# Altium schematic sheet SDEC944-xD_Fil_Pilote_2-2_(zone_jour).SchDoc: Fil Pilote (2/2)
size 393 x 270 mm; CompanyName: Seccom; Address1: 521, rue du capt. François Garbit; Address2: 69440 Mornant; Address3: seccom@seccom.fr; Address4: www.seccom.fr; DocumentNumber: 15; SheetNumber: 15; SheetTotal: 22; PageSetup: Record=PageOptions|CenterHorizontal=True|CenterVertical=True|PrintScale=0.74|XCorrection=1.00|YCorrection=1.00|PrintKind=0|BorderSize=5000000|LeftOffset=0|BottomOffset=0|Orientation=2|PaperLength=1000|PaperWidth=1000|Scale=100|PaperSource=7|PrintQuality=-4|MediaType=1|DitherType=10|PaperKind=A4|PrintScaleMode=1
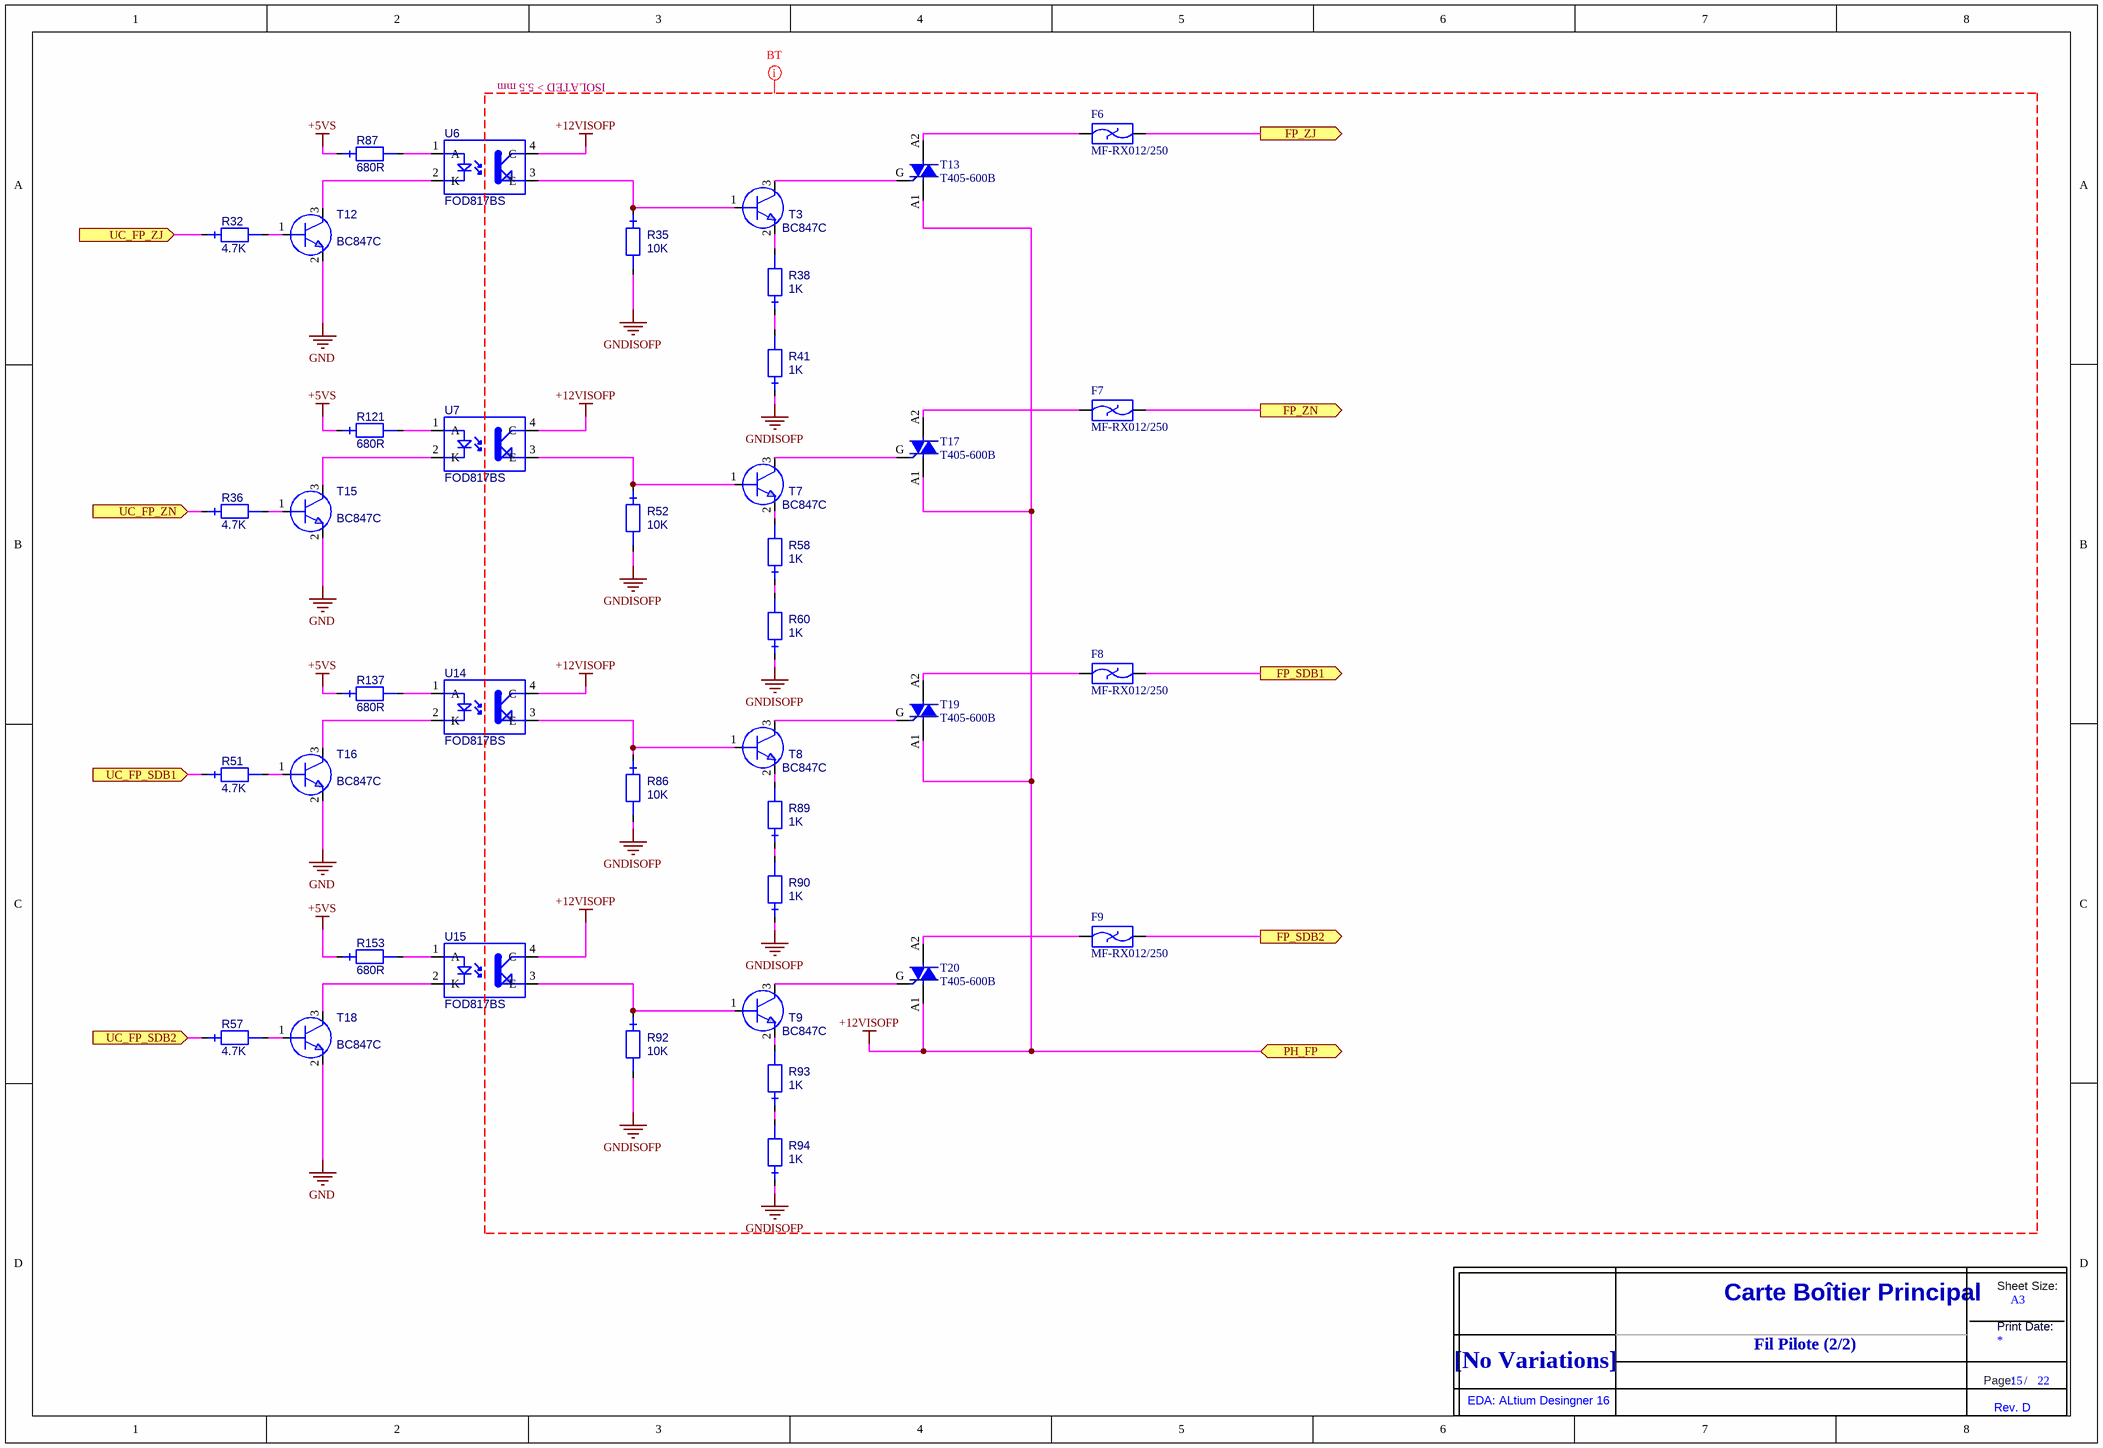
[diagram p0: SDEC944-xD_Fil_Pilote_2-2_(zone_jour).SchDoc]

## Parts
F6  MF-RX012/250  [MF-RX012-250-0]
F7  MF-RX012/250  [MF-RX012-250-0]
F8  MF-RX012/250  [MF-RX012-250-0]
F9  MF-RX012/250  [MF-RX012-250-0]
R32  value 4.7K  [0603_ReflowSoldering_RES]  (hidden comment: RES_0603_1%_100PPM_4.7K)
R35  value 10K  [0603_ReflowSoldering_RES]  (hidden comment: RES_0603_1%_100PPM_10K)
R36  value 4.7K  [0603_ReflowSoldering_RES]  (hidden comment: RES_0603_1%_100PPM_4.7K)
R38  value 1K  [0603_ReflowSoldering_RES]  (hidden comment: RES_0603_1%_100PPM_1K)
R41  value 1K  [0603_ReflowSoldering_RES]  (hidden comment: RES_0603_1%_100PPM_1K)
R51  value 4.7K  [0603_ReflowSoldering_RES]  (hidden comment: RES_0603_1%_100PPM_4.7K)
R52  value 10K  [0603_ReflowSoldering_RES]  (hidden comment: RES_0603_1%_100PPM_10K)
R57  value 4.7K  [0603_ReflowSoldering_RES]  (hidden comment: RES_0603_1%_100PPM_4.7K)
R58  value 1K  [0603_ReflowSoldering_RES]  (hidden comment: RES_0603_1%_100PPM_1K)
R60  value 1K  [0603_ReflowSoldering_RES]  (hidden comment: RES_0603_1%_100PPM_1K)
R86  value 10K  [0603_ReflowSoldering_RES]  (hidden comment: RES_0603_1%_100PPM_10K)
R87  value 680R  [0603_ReflowSoldering_RES]  (hidden comment: RES_0603_1%_100PPM_680R)
R89  value 1K  [0603_ReflowSoldering_RES]  (hidden comment: RES_0603_1%_100PPM_1K)
R90  value 1K  [0603_ReflowSoldering_RES]  (hidden comment: RES_0603_1%_100PPM_1K)
R92  value 10K  [0603_ReflowSoldering_RES]  (hidden comment: RES_0603_1%_100PPM_10K)
R93  value 1K  [0603_ReflowSoldering_RES]  (hidden comment: RES_0603_1%_100PPM_1K)
R94  value 1K  [0603_ReflowSoldering_RES]  (hidden comment: RES_0603_1%_100PPM_1K)
R121  value 680R  [0603_ReflowSoldering_RES]  (hidden comment: RES_0603_1%_100PPM_680R)
R137  value 680R  [0603_ReflowSoldering_RES]  (hidden comment: RES_0603_1%_100PPM_680R)
R153  value 680R  [0603_ReflowSoldering_RES]  (hidden comment: RES_0603_1%_100PPM_680R)
T3  BC847C  [SOT23_3L_ReflowSoldering]
T7  BC847C  [SOT23_3L_ReflowSoldering]
T8  BC847C  [SOT23_3L_ReflowSoldering]
T9  BC847C  [SOT23_3L_ReflowSoldering]
T12  BC847C  [SOT23_3L_ReflowSoldering]
T13  T405-600B  [DPAK]
T15  BC847C  [SOT23_3L_ReflowSoldering]
T16  BC847C  [SOT23_3L_ReflowSoldering]
T17  T405-600B  [DPAK]
T18  BC847C  [SOT23_3L_ReflowSoldering]
T19  T405-600B  [DPAK]
T20  T405-600B  [DPAK]
Title_new  DNI  (value not drawn)  (graphical)
U6  value FOD817BS  [OPTO_FOD817BS_ReflowSoldering]  (hidden comment: OPTO_FOD817BS)
U7  value FOD817BS  [OPTO_FOD817BS_ReflowSoldering]  (hidden comment: OPTO_FOD817BS)
U14  value FOD817BS  [OPTO_FOD817BS_ReflowSoldering]  (hidden comment: OPTO_FOD817BS)
U15  value FOD817BS  [OPTO_FOD817BS_ReflowSoldering]  (hidden comment: OPTO_FOD817BS)

## Ports
FP_SDB1 (out), FP_SDB2 (out), FP_ZJ (out), FP_ZN (out), PH_FP, UC_FP_SDB1 (in), UC_FP_SDB2 (in), UC_FP_ZJ (in), UC_FP_ZN (in)

## Nets
+5VS: R87.1 R121.1 R137.1 R153.1
+12VISOFP: T13.A1 T17.A1 T19.A1 T20.A1 U6.4(C) U7.4(C) U14.4(C) U15.4(C) ; port PH_FP
GND: T12.2(E) T15.2(E) T16.2(E) T18.2(E)
GNDISOFP: R35.2 R41.1 R52.2 R60.1 R86.2 R90.1 R92.2 R94.1
FP_SDB1: F8.2 ; port FP_SDB1
FP_SDB2: F9.2 ; port FP_SDB2
FP_ZJ: F6.2 ; port FP_ZJ
FP_ZN: F7.2 ; port FP_ZN
UC_FP_SDB1: R51.1 ; port UC_FP_SDB1
UC_FP_SDB2: R57.1 ; port UC_FP_SDB2
UC_FP_ZJ: R32.1 ; port UC_FP_ZJ
UC_FP_ZN: R36.1 ; port UC_FP_ZN
NetF6_1: F6.1 T13.A2
NetF7_1: F7.1 T17.A2
NetF8_1: F8.1 T19.A2
NetF9_1: F9.1 T20.A2
NetR32_2: R32.2 T12.1(B)
NetR35_1: R35.1 T3.1(B) U6.3(E)
NetR36_2: R36.2 T15.1(B)
NetR38_1: R38.1 R41.2
NetR38_2: R38.2 T3.2(E)
NetR51_2: R51.2 T16.1(B)
NetR52_1: R52.1 T7.1(B) U7.3(E)
NetR57_2: R57.2 T18.1(B)
NetR58_1: R58.1 R60.2
NetR58_2: R58.2 T7.2(E)
NetR86_1: R86.1 T8.1(B) U14.3(E)
NetR87_2: R87.2 U6.1(A)
NetR89_1: R89.1 R90.2
NetR89_2: R89.2 T8.2(E)
NetR92_1: R92.1 T9.1(B) U15.3(E)
NetR93_1: R93.1 R94.2
NetR93_2: R93.2 T9.2(E)
NetR121_2: R121.2 U7.1(A)
NetR137_2: R137.2 U14.1(A)
NetR153_2: R153.2 U15.1(A)
NetT3_3: T3.3(C) T13.G
NetT7_3: T7.3(C) T17.G
NetT8_3: T8.3(C) T19.G
NetT9_3: T9.3(C) T20.G
NetT12_3: T12.3(C) U6.2(K)
NetT15_3: T15.3(C) U7.2(K)
NetT16_3: T16.3(C) U14.2(K)
NetT18_3: T18.3(C) U15.2(K)

## Layout directives
net class BT: +12VISOFP, GNDISOFP

## Notes on the sheet
- ISOLATED > 5.5 mm
- Fil Pilote (2/2)
- (in symbol Title_new) Sheet Size:; Carte Boîtier Principal; A3; Print Date:; [No Variations]; Page:; /; EDA: ALtium Desingner 16; Rev. D

## Library data of the parts
F6-F9 = MF-RX012/250-0: Resettable Fuses - PPTC 0.12A 60V 4ohm Hold .12 Trip .16; Fabricant: Bourns Inc.; Ref Fab: MF-RX012/250-2; Value: MF-RX012/250-2; Supplier 1: Digi-Key; Supplier Part Number 1: MF-RX012/250-0-ND
R32 R36 R51 R57 = RES_0603_1%_100PPM_4.7K: Résistance, 0.100W, 1%, 100ppm, 75V, 4.7K; Creation: JPL (05/07/12); Boitier: 0603; Remarque: {Remarque}; Fabricant: Vishay; Ref Fab: CRCW06034K70FKEA; Coeff: 1; Verification: *; ComponentLink1URL: O:\_Documentation\Datasheets\Vishay\Resistances_D-CRCWe3.pdf; ComponentLink2URL: o:\_Documentation\Datasheets\_BOITIERS\PASSIF_CMS\; Config: *; ComponentLink1Description: Datasheet; ComponentLink2Description: Datasheet Boitier; Supplier 1: Farnell; Supplier 2: RadioSpares; Supplier Part Number 1: 1469807; Supplier Part Number 2: 6790484
R35 R52 R86 R92 = RES_0603_1%_100PPM_10K: Résistance, 0.100W, 1%, 100ppm, 75V, 10K; Creation: JPL (05/07/12); Boitier: 0603; Remarque: {Remarque}; Fabricant: Vishay; Ref Fab: CRCW060310K0FKEA; Coeff: 1; Verification: *; ComponentLink1URL: O:\_Documentation\Datasheets\Vishay\Resistances_D-CRCWe3.pdf; ComponentLink2URL: o:\_Documentation\Datasheets\_BOITIERS\PASSIF_CMS\; Config: *; ComponentLink1Description: Datasheet; ComponentLink2Description: Datasheet Boitier; Supplier 1: Farnell; Supplier 2: RadioSpares; Supplier Part Number 1: 1469748; Supplier Part Number 2: 6789667
R38 R41 R58 R60 R89 R90 R93 R94 = RES_0603_1%_100PPM_1K: Résistance, 0.100W, 1%, 100ppm, 75V, 1K; Creation: JPL (05/07/12); Boitier: 0603; Remarque: {Remarque}; Fabricant: Vishay; Ref Fab: CRCW06031K00FKEA; Coeff: 1; Verification: *; ComponentLink1URL: O:\_Documentation\Datasheets\Vishay\Resistances_D-CRCWe3.pdf; ComponentLink2URL: o:\_Documentation\Datasheets\_BOITIERS\PASSIF_CMS\; Config: *; ComponentLink1Description: Datasheet; ComponentLink2Description: Datasheet Boitier; Supplier 1: Farnell; Supplier 2: RadioSpares; Supplier Part Number 1: 1469740; Supplier Part Number 2: 6789875
R87 R121 R137 R153 = RES_0603_1%_100PPM_680R: Résistance, 0.100W, 1%, 100ppm, 75V, 680R; Creation: FB (02/08/12); Boitier: 0603; Remarque: {Remarque}; Fabricant: Vishay; Ref Fab: CRCW0603680RFKEA; Coeff: 1; Verification: *; ComponentLink1URL: O:\_Documentation\Datasheets\Vishay\Resistances_D-CRCWe3.pdf; ComponentLink2URL: o:\_Documentation\Datasheets\_BOITIERS\PASSIF_CMS\; Config: *; ComponentLink1Description: Datasheet; ComponentLink2Description: Datasheet Boitier; Supplier 1: Farnell; Supplier Part Number 1: 1469834; Supplier 2: Mouser; Supplier Part Number 2: 71-CRCW0603-680-E3
T3 T7-T9 T12 T15 T16 T18 = BC847C: Transistor NPN, Vce=50V, Ic=0.1A, hfe=420~800, 0.25W, CMS; Creation: GO (08/07/05); Verification: LJ (21/07/05); Reference: 000329/00; Boitier: SOT23_3L; Remarque: Complementaires aux BC856-860; Fabricant: NXP; Coeff: 1; Ref Fab: BC847C; ComponentLink1URL: O:\_Documentation\Datasheets\NXP\BC847.pdf; ComponentLink2URL: o:\_Documentation\Datasheets\_BOITIERS\ACTIF_CMS\SOT\SOT_23_3P_(Schneider).PDF; Config: *; ComponentLink1Description: Datasheet; Value: BC847C; Supplier 1: Farnell; Supplier Part Number 1: 1081235; ComponentLink2Description: Datasheet Boitier
T13 T17 T19 T20 = T405-600B-TR: TRIAC SENS GATE 600V 4A DPAK; Manufacturer: STMicroelectronics; Triac Type: Logic - Sensitive Gate; Voltage - Gate Trigger (Vgt) (Max): 1.3V; Current - Non Rep. Surge 50, 60Hz (Itsm): 30A, 31A; Current - Gate Trigger (Igt) (Max): 5mA; Current - Hold (Ih) (Max): 10mA; Configuration: Single; Supplier 1: Digi-Key; RoHS: RoHS Compliant; Category: Discrete Semiconductor Products; Stock 1: 12315; Pricing 1: 1=0.97, 10=0.866, 100=0.6755, 500=0.5586, 1000=0.44175 (USD); Packaging: Cut Tape (CT); Part Status: Active; Voltage - Off State: 600V; Current - On State (It (RMS)) (Max): 4A; Operating Temperature: -40°C ~ 150°C (TJ); Mounting Type: Surface Mount; Package / Case: TO-252-3, DPak (2 Leads + Tab), SC-63; Supplier Device Package: D-Pak; ComponentLink1URL: http://www.st.com/content/ccc/resource/technical/document/datasheet/cf/95/c3/9d/a2/b7/47/43/CD00002383.pdf/files/CD00002383.pdf/_jcr_content/translations/en.CD00002383.pdf; ComponentLink1Description: http://www.st.com/content/ccc/resource/technical/document/datasheet/cf/95/c3/9d/a2/b7/47/43/CD00002383.pdf/files/CD00002383.pdf/_jcr_content/translations/en.CD00002383.pdf; Supplier Part Number 1: 497-2505-1-ND; Manufacturer Part Number: T405-600B-TR; Fabricant: STMicroelectronics; Ref Fab: T405-600B-TR; Value: T405-600B
Title_new = Title_new
U6 U7 U14 U15 = OPTO_FOD817BS: Optocouleur simple, IR GaAs, Viso=5kVrms, If=50mA, Vce=70V, Ic=50mA, CTR=130-260, CMS; Creation: FB (10/07/12); Boitier: MDIP4-SM; Remarque: {Remarque}; Coeff: 1; Fabricant: Fairchild; Verification: *; ComponentLink1URL: O:\_Documentation\Datasheets\Fairchild\FOD814A.pdf; ComponentLink2URL: o:\_Documentation\Datasheets\; Config: *; ComponentLink1Description: Datasheet; ComponentLink2Description: Datasheet Boitier; Ref Fab: FOD817BS; Supplier Part Number 1: 512-FOD817BS; Supplier 1: Mouser